# EAGLE design MaxMotor (EAGLE 7.7.0)
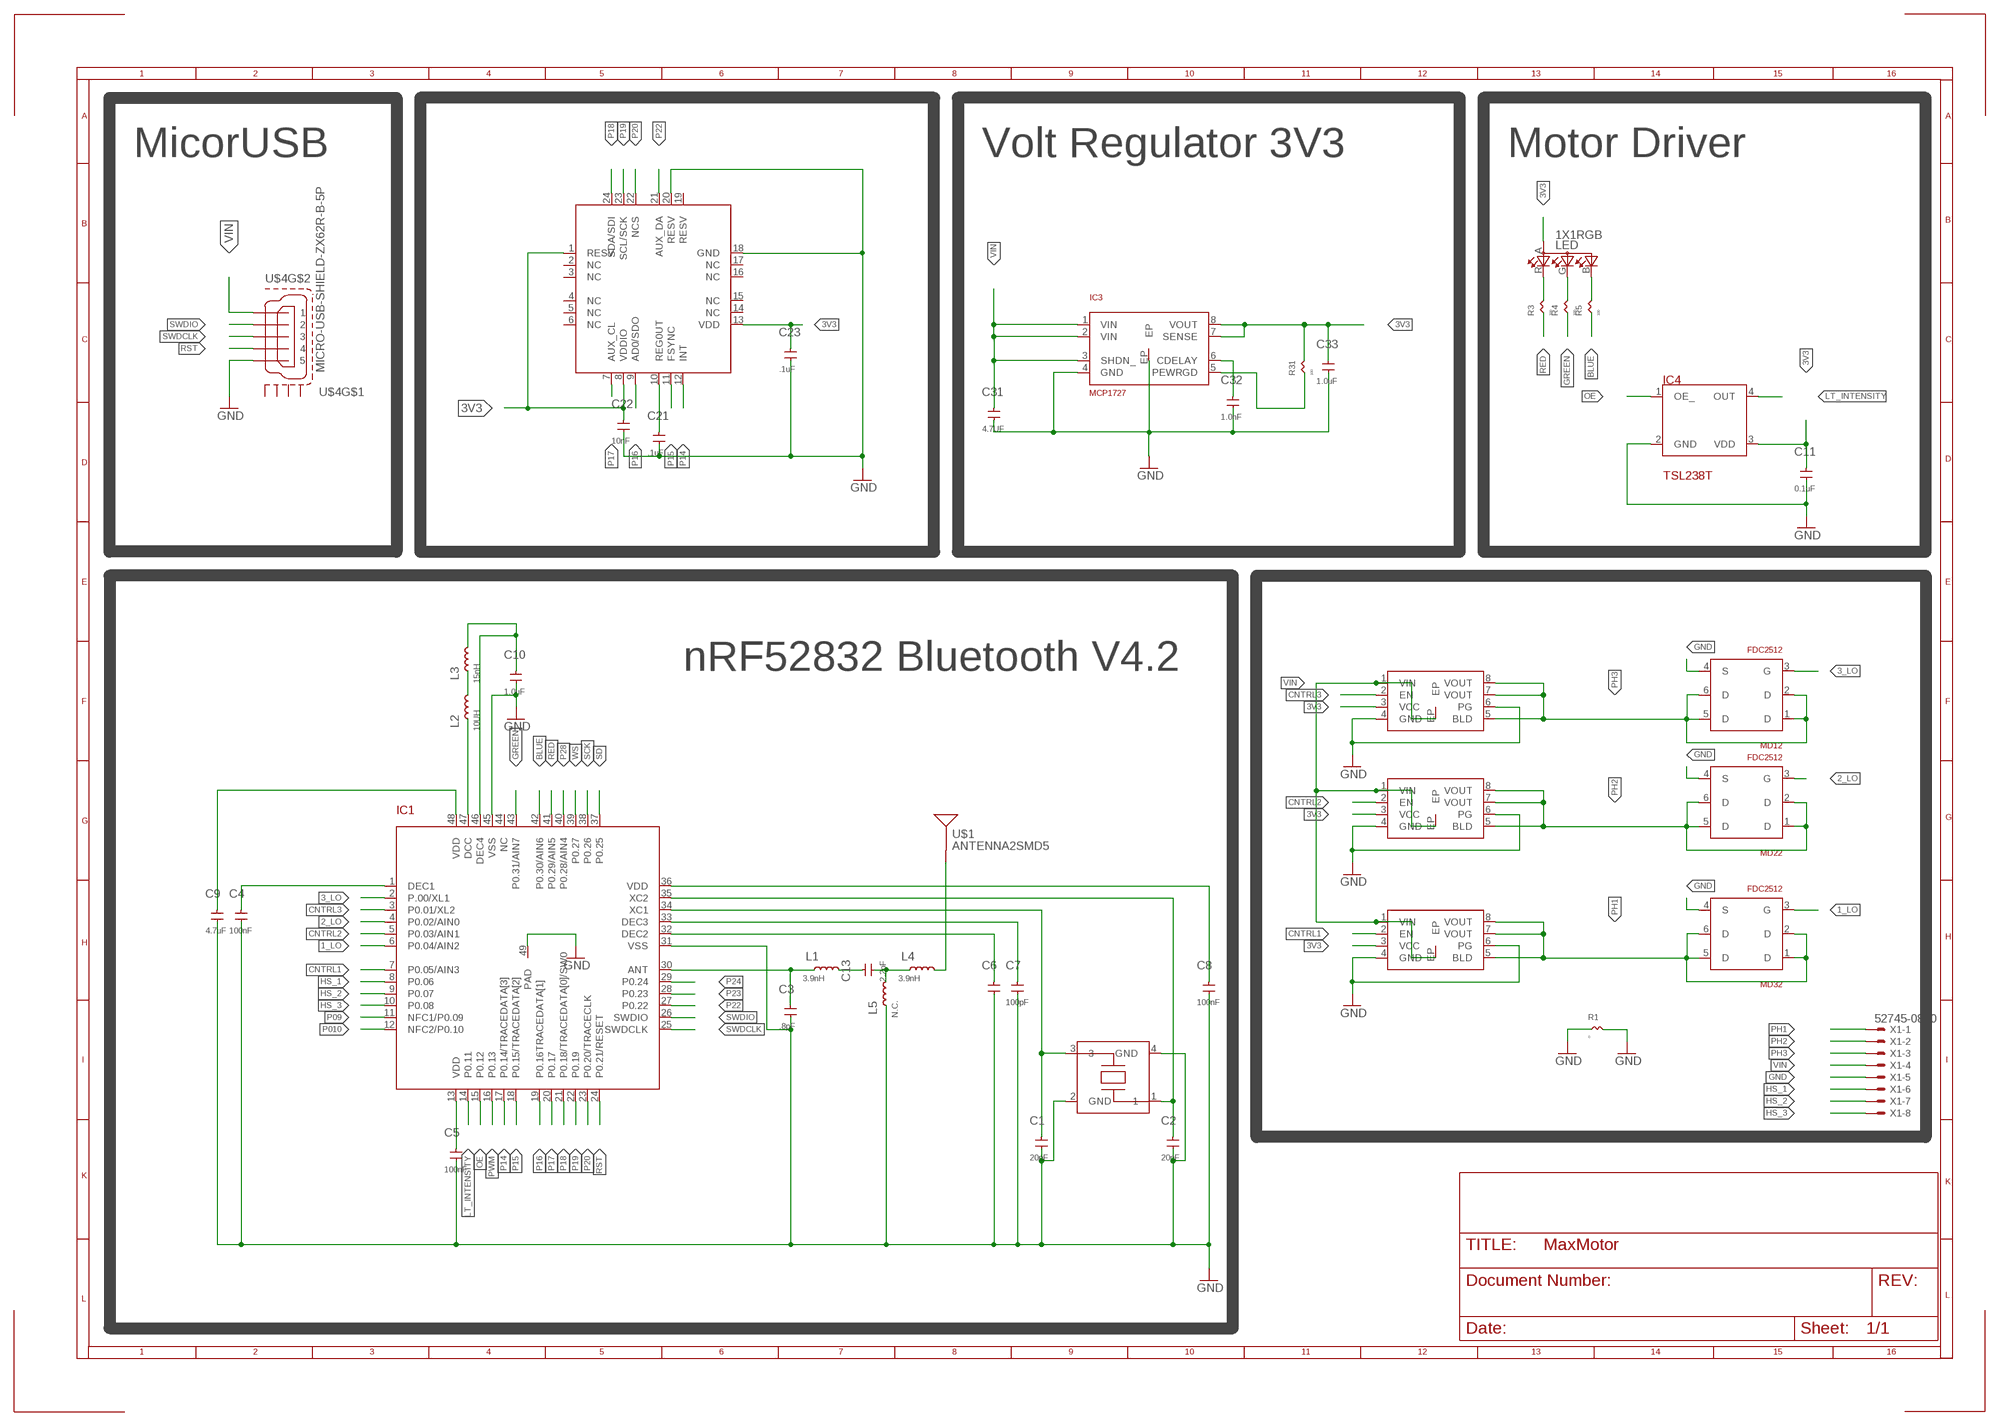
[diagram p0: schematic, sheet 1, part 1 of 2]
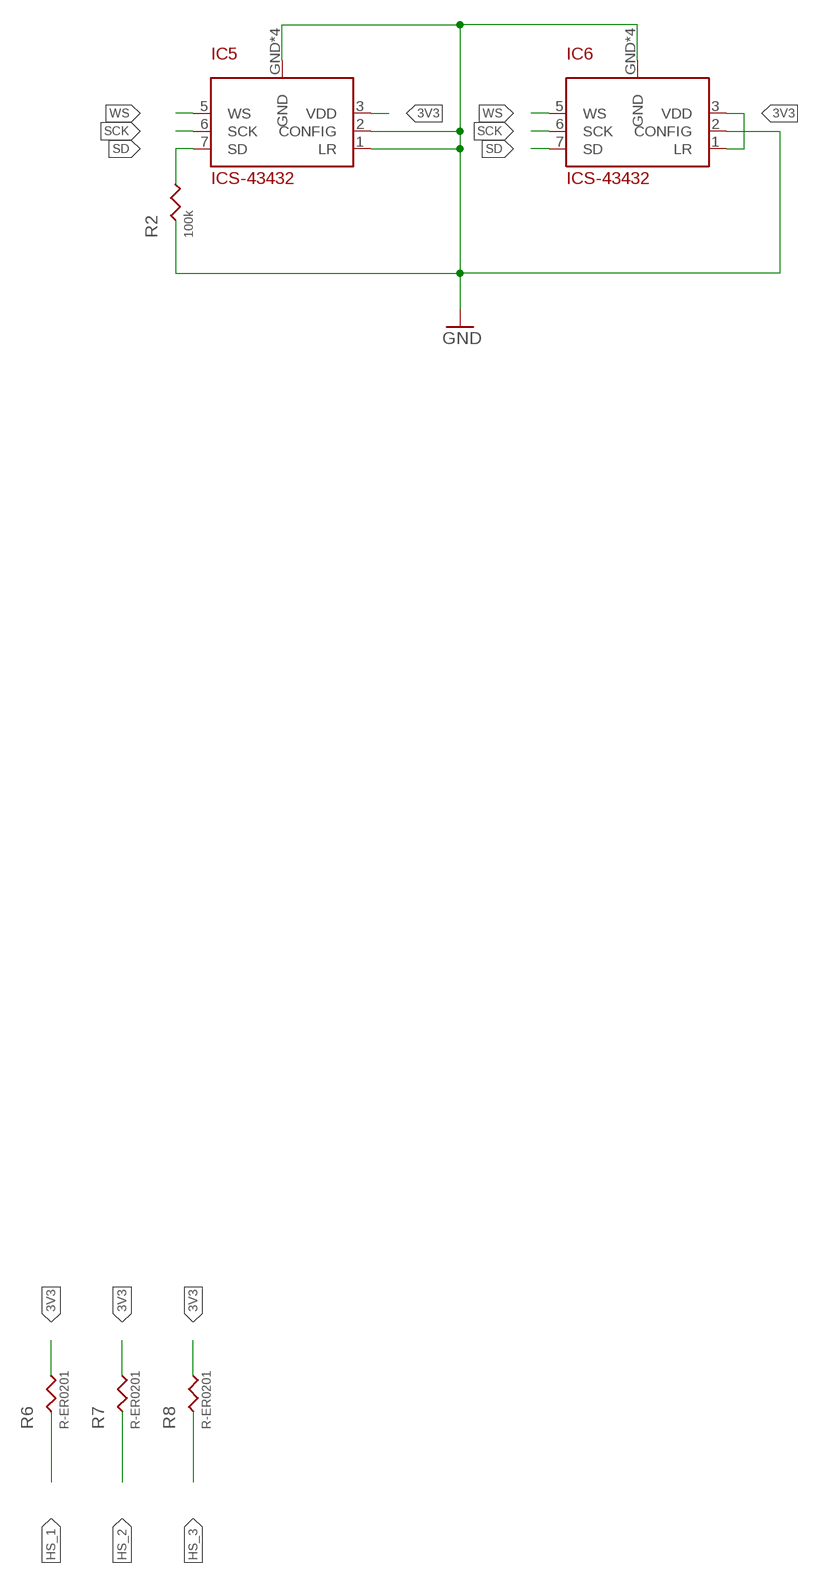
[diagram p1: schematic, sheet 1, part 2 of 2]

## Parts
C1  20pF  C-ERC0402  [C0402]
C2  20pF  C-ERC0402  [C0402]
C3  .8pF  C-ERC0402  [C0402]
C4  100nF  C-ERC0402  [C0402]
C5  100nF  C-ERC0402  [C0402]
C6  C-ERC0402  [C0402]
C7  100pF  C-ERC0402  [C0402]
C8  100nF  C-ERC0402  [C0402]
C9  4.7uF  C-ER  [C0805]
C10  1.0uF  C-ERC0402  [C0402]
C11  0.1uF  C-ERC0402  [C0402]
C13  2.2pF  C-ERC0402  [C0402]
C21  .1uF  C-ERC0402  [C0402]
C22  10nF  C-ERC0402  [C0402]
C23  .1uF  C-ERC0402  [C0402]
C31  4.7UF  C-ER  [C0805]
C32  1.0nF  C-ERC0402  [C0402]
C33  1.0uF  C-ERC0402  [C0402]
IC1  NRF52832  [QFN48]
IC2  MPU9250_CORRECTED  [3X3_24_QFN_CORRECTED]
IC3  MCP1727  [DFN8-3X3]
IC4  TSL238T  [T4]
IC5  ICS-43432  [ICS-43432]
IC6  ICS-43432  [ICS-43432]
L1  3.9nH  L-ERL402  [R0402]
L2  10UH  L-ERL603  [R0603]
L3  15nH  L-ERL402  [R0402]
L4  3.9nH  L-ERL402  [R0402]
L5  N.C.  L-ERL402  [R0402]
LED  1X1RGB  [1X1]
MD12  FDC2512  [SSOT6]
MD22  FDC2512  [SSOT6]
MD32  FDC2512  [SSOT6]
R1  0  R-ER-TINYR402  [R0402]
R2  100k  R-ERR0402  [R0402]
R3  100  R-ER-TINYR402  [R0402]
R4  100  R-ER-TINYR402  [R0402]
R5  100  R-ER-TINYR402  [R0402]
R6  R-ER0201  [R0201]
R7  R-ER0201  [R0201]
R8  R-ER0201  [R0201]
R31  100  R-ER-TINYR402  [R0402]
U$1  ANTENNA2SMD5  [ANTENNA-CHIP5]
U$2  NCP45524/25  [DFN8]
U$4  MICRO-USB-SHIELD-ZX62R-B-5P  [ZX62R-B-5P]
U$5  NCP45524/25  [DFN8]
U$6  NCP45524/25  [DFN8]
X1  52745-0890  [52745-0890]
XTL16M  FA-128  [FA-128]

## Nets
1_LO: IC1.6(P0.04/AIN2) MD32.3(G)
2_LO: IC1.4(P0.02/AIN0) MD22.3(G)
3_LO: IC1.2(P.00/XL1) MD12.3(G)
3V3: C5.2 C8.2 C9.2 C11.2 C22.2 C23.2 C33.2 IC1.13(VDD) IC1.36(VDD) IC1.48(VDD) IC2.1(RESV) IC2.8(VDDIO) IC2.13(VDD) IC3.7(SENSE) IC3.8(VOUT) IC4.3(VDD) IC5.3(VDD) IC6.1(LR) IC6.3(VDD) LED.A(A2) R6.2 R7.2 R8.2 R31.2 U$2.3(VCC) U$5.3(VCC) U$6.3(VCC)
BLUE: IC1.42(P0.30/AIN6) R5.1
CNTRL1: IC1.7(P0.05/AIN3) U$6.2(EN)
CNTRL2: IC1.5(P0.03/AIN1) U$5.2(EN)
CNTRL3: IC1.3(P0.01/XL2) U$2.2(EN)
GND: C1.1 C2.1 C3.1 C4.1 C5.1 C6.1 C7.1 C8.1 C9.1 C10.1 C11.1 C21.1 C22.1 C23.1 C31.1 C32.1 C33.1 IC1.31(VSS) IC1.45(VSS) IC1.49(PAD) IC2.18(GND) IC2.20(RESV) IC3.4(GND) IC3.EP IC4.2(GND) IC5.1(LR) IC5.2(CONFIG) IC5.GND IC5.GND@1(GND) IC5.GND@2(GND) IC5.GND@(GND) IC6.2(CONFIG) IC6.GND IC6.GND@1(GND) IC6.GND@2(GND) IC6.GND@(GND) L5.1 MD12.4(S) MD22.4(S) MD32.4(S) R1.1 R1.2 R2.1 U$2.4(GND) U$2.6(PG) U$4.1 U$5.4(GND) U$5.6(PG) U$6.4(GND) U$6.6(PG) X1.5 XTL16M.2(GND) XTL16M.4(GND)
GREEN: IC1.43(P0.31/AIN7) R4.1
HS_1: IC1.8(P0.06) R6.1 X1.6
HS_2: IC1.9(P0.07) R7.1 X1.7
HS_3: IC1.10(P0.08) R8.1 X1.8
LT_INTENSITY: IC1.14(P0.11) IC4.4(OUT)
N$1: C21.2 IC2.10(REG0UT)
N$4: C3.2 IC1.30(ANT) L1.1
N$5: C6.2 IC1.32(DEC2)
N$6: C13.2 L1.2
N$7: C7.2 IC1.33(DEC3)
N$8: C1.2 IC1.34(XC1) XTL16M.3
N$9: C2.2 IC1.35(XC2) XTL16M.1
N$11: IC1.47(DCC) L2.1
N$12: L2.2 L3.1
N$13: C10.2 IC1.46(DEC4) L3.2
N$16: LED.B(CGREEN) R5.2
N$19: C13.1 L4.1 L5.2
N$20: L4.2 U$1.FEED(SIGNAL)
N$24: LED.G(CBLUE) R4.2
N$25: IC3.5(PEWRGD) R31.1
N$26: LED.R(CRED) R3.2
N$27: C32.2 IC3.6(CDELAY)
N$36: C4.2 IC1.1(DEC1)
OE: IC1.15(P0.12) IC4.1(OE_)
P09: IC1.11(NFC1/P0.09)
P010: IC1.12(NFC2/P0.10)
P14: IC1.17(P0.14/TRACEDATA[3]) IC2.12(INT)
P15: IC1.18(P0.15/TRACEDATA[2]) IC2.11(FSYNC)
P16: IC1.19(P0.16TRACEDATA[1]) IC2.9(AD0/SDO)
P17: IC1.20(P0.17) IC2.7(AUX_CL)
P18: IC1.21(P0.18/TRACEDATA[0]/SW0) IC2.24(SDA/SDI)
P19: IC1.22(P0.19) IC2.23(SCL/SCK)
P20: IC1.23(P0.20/TRACECLK) IC2.22(NCS)
P22: IC1.27(P0.22) IC2.21(AUX_DA)
P23: IC1.28(P0.23)
P24: IC1.29(P0.24)
P28: IC1.40(P0.28/AIN4)
PH1: MD32.1(D) MD32.2(D) MD32.5(D) MD32.6(D) U$6.5(BLD) U$6.7(VOUT) U$6.8(VOUT) X1.1
PH2: MD22.1(D) MD22.2(D) MD22.5(D) MD22.6(D) U$5.5(BLD) U$5.7(VOUT) U$5.8(VOUT) X1.2
PH3: MD12.1(D) MD12.2(D) MD12.5(D) MD12.6(D) U$2.5(BLD) U$2.7(VOUT) U$2.8(VOUT) X1.3
PWM: IC1.16(P0.13)
RED: IC1.41(P0.29/AIN5) R3.1
RST: IC1.24(P0.21/RESET) U$4.2
SCK: IC1.38(P0.26) IC5.6(SCK) IC6.6(SCK)
SD: IC1.37(P0.25) IC5.7(SD) IC6.7(SD) R2.2
SWDCLK: IC1.25(SWDCLK) U$4.3
SWDIO: IC1.26(SWDIO) U$4.4
VIN: C31.2 IC3.1(VIN) IC3.2(VIN) IC3.3(SHDN_) U$2.1(VIN) U$2.EP U$4.5 U$5.1(VIN) U$5.EP U$6.1(VIN) U$6.EP X1.4
WS: IC1.39(P0.27) IC5.5(WS) IC6.5(WS)
Unconnected: IC1.44(NC) IC2.2(NC) IC2.3(NC) IC2.4(NC) IC2.5(NC) IC2.6(NC) IC2.14(NC) IC2.15(NC) IC2.16(NC) IC2.17(NC) IC2.19(RESV) U$4.M1(S1) U$4.M2(S2) U$4.M3(S3) U$4.M4(S4)

## Notes on the sheet
- MicorUSB | Volt Regulator 3V3 | Motor Driver
- nRF52832 Bluetooth V4.2

## Library data of the parts
C1-C11 C13 C21-C23 C31-C33 = rcl:C-ER
IC1 = Nordic:NRF52832
IC2 = invensense:MPU9250_CORRECTED
IC3 = microchip:MCP1727
IC4 = AMS:TSL238T
IC5 IC6 = invensense:ICS-43432
L1-L5 = rcl:L-ER
LED = led:1X1RGB
MD12 MD22 MD32 = transistor-fet:FDC2512
R1 R3-R5 R31 = rcl:R-ER-TINY
R2 R6-R8 = rcl:R-ER
U$1 = SparkFun:ANTENNA2: Antenna Single endded antenna. Common with smaller chip antennas. CHIP4 package is the GPS Chip Antenna SKU: GPS-08418. CHIP5 package is 2.4GHz chip antenna SKU: WRL-00144.
U$2 U$5 U$6 = transistor-fet:NCP45524/25
U$4 = con-hirose:MICRO-USB-SHIELD-: Hirose Micro USB Connector ZX62R-B-5P: Micro B, reverse (top mount) shell SMT Supplier: DigiKey H11574CT-ND Source: http://www.hirose.co.jp/cataloge_hp/e24200011.pdf
X1 = con-molex:52745-0890: FFC/FPC-to-Board 0.50mm (.020") SMT Top Contact Right Angle, ZIF, Style Receptacle 52745 / 52435 Source: http://www.molex.com/product/ffc/52745.html
XTL16M = crystal:FA-128

## Board
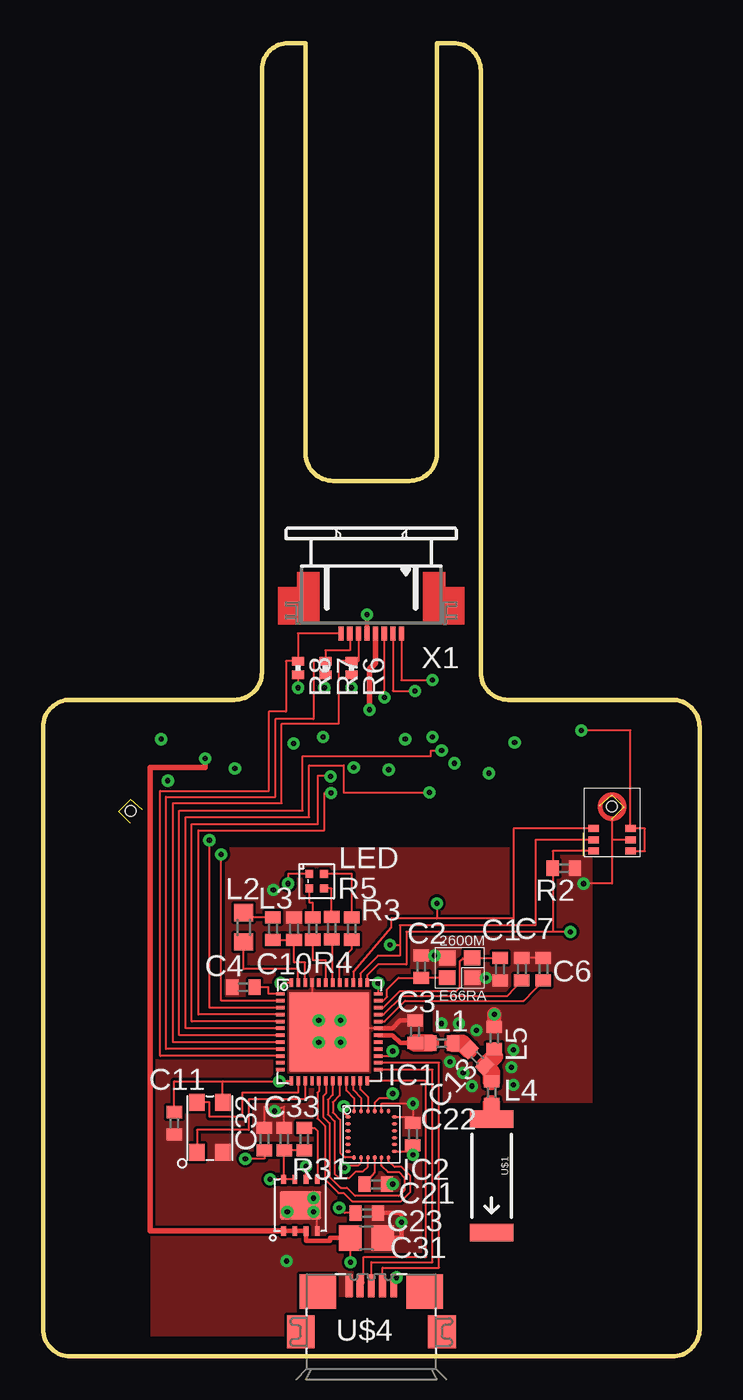
[diagram p2: board, top side]
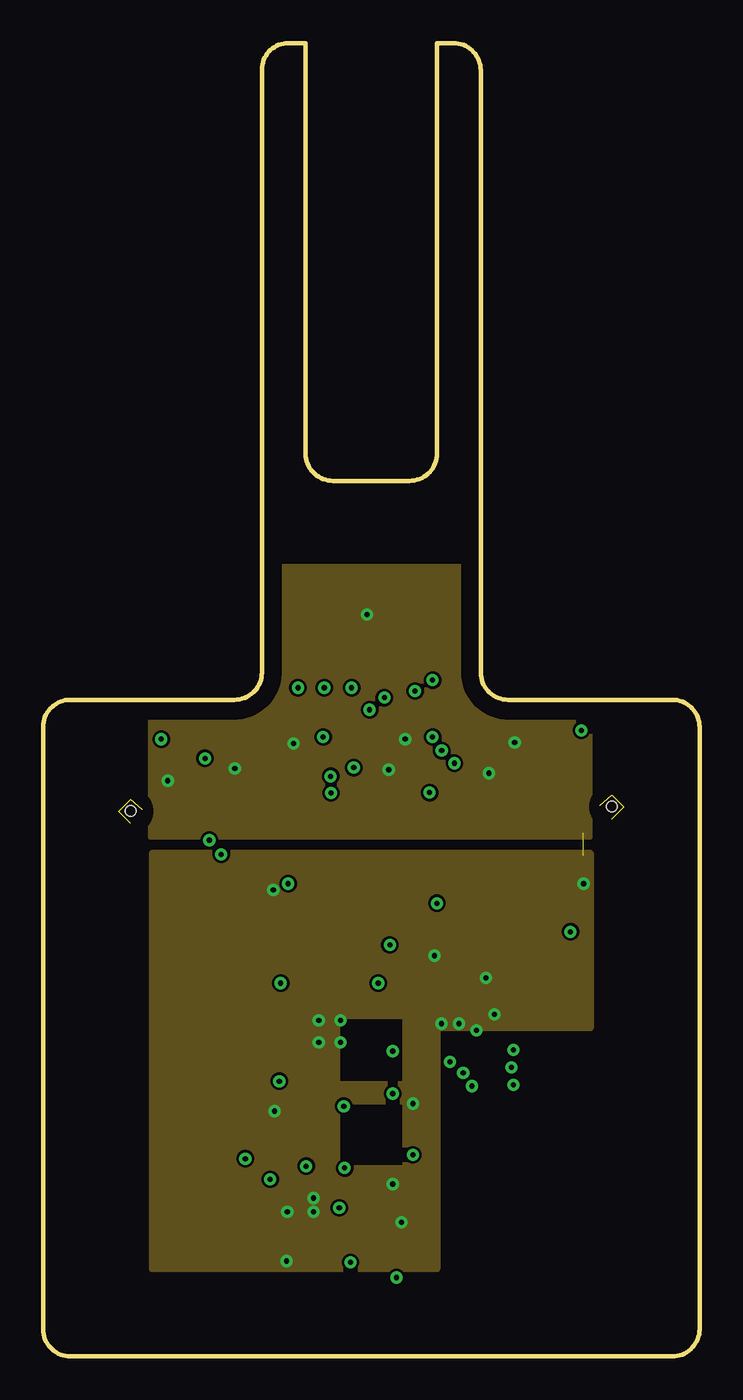
[diagram p3: board, inner layer Route2]
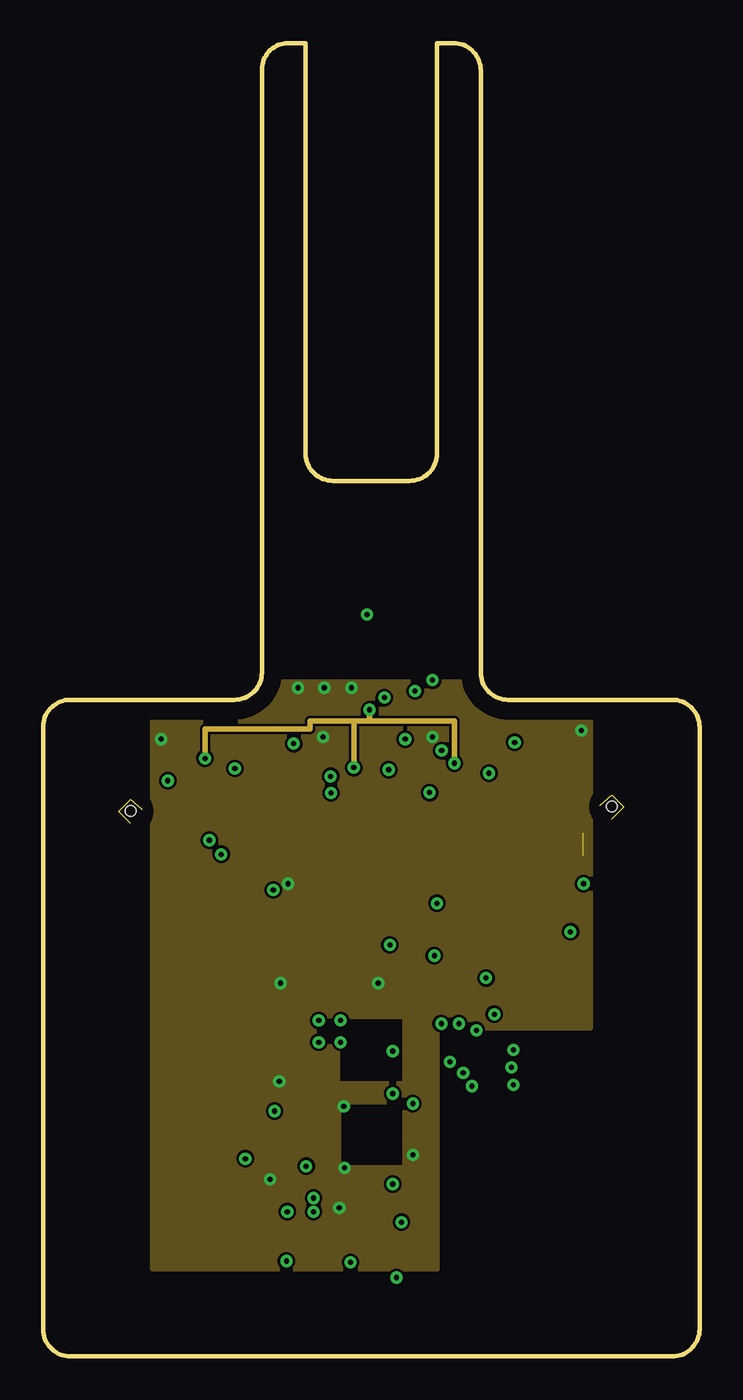
[diagram p4: board, inner layer Route3]
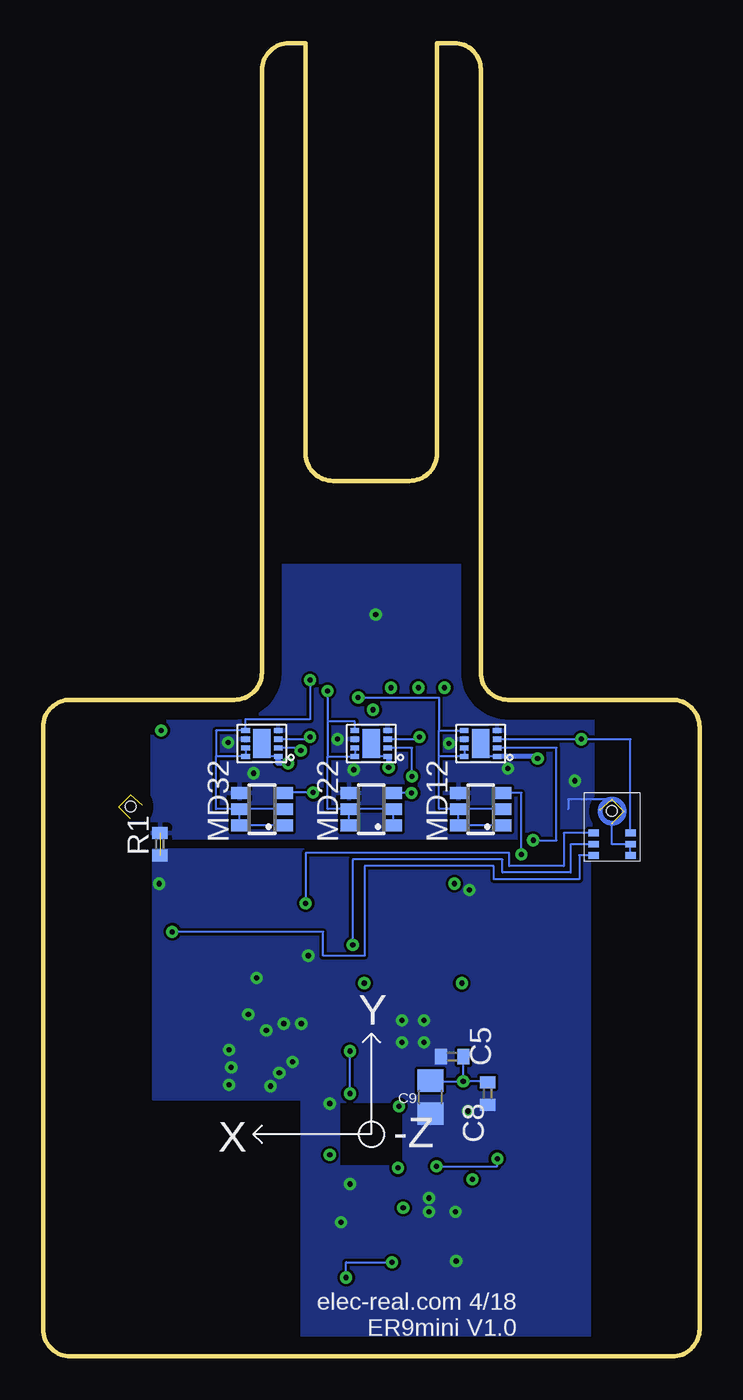
[diagram p5: board, bottom side, seen from below]

Size 38.1 x 76.2 mm. Coordinates in mm from the lower left corner, seen from the top.
Outline: 1.59,0 36.51,0 arc90 38.1,1.59 38.1,36.51 arc90 36.51,38.1 26.99,38.1 arc-90 25.4,39.69 25.4,74.61 arc90 23.81,76.2 22.86,76.2 22.86,52.39 arc-90 21.27,50.8 16.83,50.8 arc-90 15.24,52.39 15.24,76.2 14.22,76.2 arc90 12.7,74.68 12.7,39.69 arc-90 11.11,38.1 1.59,38.1 arc90 0,36.51 0,1.59 arc90 1.59,0
Copper layers (1*2+3*16): Top 0.055mm / dielectric 0.46mm / Route2 0.055mm / dielectric 0.46mm / Route3 0.055mm / dielectric 0.46mm / Bottom 0.055mm
Design rules "default *": minimum track width 5mil, minimum drill 11mil, track to track 6mil, track to pad 6mil, pad to pad 6mil, via to via 6mil, smd to smd 6mil, copper to edge 40mil, drill to drill 8mil, minimum pad ring 10mil, minimum via ring 8mil, stop-mask expansion 4mil, vias tented up to drill 0mil, thermal gap 10mil

### Footprints (pad centres in the part's own frame; a part is rotated, then mirrored left to right if it is on the bottom)
C0402 = smd 0.7 x 0.9: 1 -0.65,0; 2 0.65,0
C0805 = smd 1.3 x 1.5: 1 -0.95,0; 2 0.95,0
QFN48 = smd 0.5 x 0.2: 1 -2.85,2.2; 2 -2.85,1.8; 3 -2.85,1.4; 4 -2.85,1; 5 -2.85,0.6; 6 -2.85,0.2; 7 -2.85,-0.2; 8 -2.85,-0.6; 9 -2.85,-1; 10 -2.85,-1.4; 11 -2.85,-1.8; 12 -2.85,-2.2; 25 2.85,-2.2; 26 2.85,-1.8; 27 2.85,-1.4; 28 2.85,-1; 29 2.85,-0.6; 30 2.85,-0.2; 31 2.85,0.2; 32 2.85,0.6; 33 2.85,1; 34 2.85,1.4; 35 2.85,1.8; 36 2.85,2.2 | smd 0.2 x 0.5: 13 -2.2,-2.85; 14 -1.8,-2.85; 15 -1.4,-2.85; 16 -1,-2.85; 17 -0.6,-2.85; 18 -0.2,-2.85; 19 0.2,-2.85; 20 0.6,-2.85; 21 1,-2.85; 22 1.4,-2.85; 23 1.8,-2.85; 24 2.2,-2.85; 37 2.2,2.85; 38 1.8,2.85; 39 1.4,2.85; 40 1,2.85; 41 0.6,2.85; 42 0.2,2.85; 43 -0.2,2.85; 44 -0.6,2.85; 45 -1,2.85; 46 -1.4,2.85; 47 -1.8,2.85; 48 -2.2,2.85 | smd 4.6 x 4.6: 49 0,0
3X3_24_QFN_CORRECTED = smd 0.3 x 0.2: 1 -1.35,1; 2 -1.35,0.6; 3 -1.35,0.2; 4 -1.35,-0.2; 5 -1.35,-0.6; 6 -1.35,-1; 13 1.35,-1; 14 1.35,-0.6; 15 1.35,-0.2; 16 1.35,0.2; 17 1.35,0.6; 18 1.35,1 | smd 0.2 x 0.3: 7 -1,-1.35; 8 -0.6,-1.35; 9 -0.2,-1.35; 10 0.2,-1.35; 11 0.6,-1.35; 12 1,-1.35; 19 1,1.35; 20 0.6,1.35; 21 0.2,1.35; 22 -0.2,1.35; 23 -0.6,1.35; 24 -1,1.35
DFN8-3X3 = smd 0.5 x 0.3: 1 -1.5,0.975; 2 -1.5,0.325; 3 -1.5,-0.325; 4 -1.5,-0.975; 5 1.5,-0.975; 6 1.5,-0.325; 7 1.5,0.325; 8 1.5,0.975 | smd 1.6 x 2.4: EP 0,0
T4 = smd 1 x 0.9: 1 -1.45,0.75; 2 -1.45,-0.75; 3 1.45,-0.75; 4 1.45,0.75
ICS-43432 = smd 0.6 x 0.4: 1 1.075,-0.65; 2 1.075,0; 3 1.075,0.65; 5 -1.075,0.65; 6 -1.075,0; 7 -1.075,-0.65 | smd 0.1 x 0.1: GND 0.7,1.9; GND@ 0,1.2; GND@1 0,2.6; GND@2 -0.7,2 | hole 0.6: 0,1.925
R0402 = smd 0.7 x 0.9: 1 -0.65,0; 2 0.65,0
R0603 = smd 1 x 1.1: 1 -0.85,0; 2 0.85,0
1X1 = smd 0.45 x 0.45: A 0.425,0.425; B -0.425,-0.425; G -0.425,0.425; R 0.425,-0.425
SSOT6 = smd 0.69 x 0.99: 1 -0.95,-1.3; 2 0,-1.3; 3 0.95,-1.3; 4 0.95,1.3; 5 0,1.3; 6 -0.95,1.3
R0201 = smd 0.5 x 0.7: 1 -0.4,0; 2 0.4,0
ANTENNA-CHIP5 = smd 1.016 x 2.54: FEED -3.302,0; NC 3.302,0
DFN8 = smd 0.5 x 0.3: 1 -0.95,0.75; 2 -0.95,0.25; 3 -0.95,-0.25; 4 -0.95,-0.75; 5 0.95,-0.75; 6 0.95,-0.25; 7 0.95,0.25; 8 0.95,0.75 | smd 1 x 1.7: EP 0,0
ZX62R-B-5P = smd 1.35 x 0.4: 1 2.675,1.3; 2 2.675,0.65; 3 2.675,0; 4 2.675,-0.65; 5 2.675,-1.3 | smd 1.9 x 1.6: M1 0,-4.1; M2 0,4.1 | smd 2 x 2.1: M3 2.35,3.1; M4 2.35,-3.1
52745-0890 = smd 0.3 x 0.8: 1 -1.75,2.5; 2 -1.25,2.5; 3 -0.75,2.5; 4 -0.25,2.5; 5 0.25,2.5; 6 0.75,2.5; 7 1.25,2.5; 8 1.75,2.5
FA-128 = smd 0.95 x 0.85: 1 -0.725,-0.575; 2 0.725,-0.575; 3 0.725,0.575; 4 -0.725,0.575

### Placement (x,y rotation side)
C1  26.52,22.47 90 top
C2  21.95,22.62 270 top
C3  21.59,18.83 270 top
C4  11.63,21.42 0 top
C5  14.36,17.39 0 bottom
C6  29.03,22.47 270 top
C7  27.79,22.47 270 top
C8  12.29,15.25 90 bottom
C9  15.62,15.05 90 bottom
C10  14.57,24.82 270 top
C11  7.62,13.53 90 top
C13  25.18,17.33 135 top
C21  19.3,9.99 180 top
C22  21.46,12.89 270 top
C23  18.8,8.32 180 top
C31  18.77,6.87 180 top
C32  12.85,12.61 270 top
C33  14,12.61 270 top
IC1  16.61,18.83 0 top
IC2  19.05,12.89 0 top
IC3  14.94,8.78 90 top
IC4  9.68,13.3 90 top
IC5  5.08,29.72 0 bottom
IC6  33.02,29.97 0 top
L1  23.14,18.17 0 top
L2  11.65,24.89 90 top
L3  13.35,24.82 270 top
L4  26.04,15.3 270 top
L5  26.19,18.48 270 top
LED  15.88,27.57 90 top
MD12  12.7,31.75 90 bottom
MD22  19.05,31.75 90 bottom
MD32  25.4,31.75 90 bottom
R1  31.32,29.72 90 bottom
R2  30.23,28.32 180 top
R3  17.92,24.83 90 top
R4  15.66,24.83 90 top
R5  16.75,24.84 90 top
R6  17.91,39.94 270 top
R7  16.38,39.94 270 top
R8  14.8,39.94 270 top
R31  15.16,12.61 270 top
U$1  26.04,10.48 270 top
U$2  12.7,35.56 180 bottom
U$4  19.05,1.42 90 top
U$5  19.05,35.56 180 bottom
U$6  25.4,35.56 180 bottom
X1  19.05,44.45 180 top
XTL16M  24.18,22.54 0 top

### Tracks (layer width: path | path; a pad name or v marks a point on that pad's centre or on a via)
1_LO  (via drill 0.3)
  Top 0.127: IC1.6 8.28,19.03 8.28,31.29 15.44,31.29 15.44,34.29 17.45,34.29 17.45,32.72 v22.43,32.72
  Bottom 0.127: v22.43,32.72 24.1,32.72 MD32.3
2_LO  (via drill 0.3)
  Top 0.127: IC1.4 9.02,19.83 9.02,30.53 16.33,30.53 16.33,32.69 v16.71,32.69
  Bottom 0.127: v16.71,32.69 v16.71,32.7 MD22.3
3_LO  (via drill 0.3)
  Top 0.127: IC1.2 10.34,20.63 v10.34,29.13
  Bottom 0.127: v10.34,29.13 10.34,32.7 MD12.3
3V3  (via drill 0.3)
  Top 0.127: IC1.48 13.8,21.68 v13.79,21.65 | IC1.36 19.46,21.47 v19.46,21.65 | IC3.7 IC3.8 | R31.2 C33.2 13.96,11.96 IC3.8 | IC3.8 13.49,10.28 v13.18,10.27 | IC2.8 18.45,11.22 18.29,11.06 17.68,11.06 v17.5,10.94 | IC2.13 21.27,11.89 v21.46,11.7 C22.2 | IC2.1 17.45,14.14 v17.45,14.52 | C23.2 17.5,8.32 v17.2,8.62 | IC4.3 10.43,15.96 | 10.43,15.96 v13.72,15.96 14.41,15.96 IC1.13 | C11.2 7.62,15.96 10.43,15.96 | LED.A 14.22,28 v14.22,27.43 | v31.24,36.32 34.09,36.32 IC6.3 34.92,30.62 34.92,29.32 IC6.1 | R6.2 v17.91,38.8 | R7.2 16.45,38.8 v16.32,38.8 | R8.2 v14.8,38.8
  Bottom 0.127: C8.2 12.29,15.96 v13.72,15.96 | v13.72,15.96 13.72,17.06 C5.2 | C9.2 15.62,15.96 v13.72,15.96 | U$6.3 22.61,35.81 v22.61,35.94 | U$5.3 16.26,35.81 v16.26,35.94 | IC5.3 4,35.81 v6.86,35.81 U$2.3
  pour Route3 (no thermals): 6.35,39.12 31.75,39.12 31.75,19.05 22.86,19.05 22.86,5.08 6.35,5.08
BLUE
  Top 0.127: IC1.42 16.81,24.13 R5.1
CNTRL1  (via drill 0.3)
  Top 0.127: IC1.7 7.9,18.63 7.9,31.67 15.06,31.67 15.06,34.82 22.5,34.82 22.5,35.15 v23.14,35.15
  Bottom 0.127: v23.14,35.15 23.14,35.31 U$6.2
CNTRL2  (via drill 0.3)
  Top 0.127: IC1.5 8.64,19.43 8.64,30.89 15.95,30.89 15.95,33.71 16.69,33.71 v16.69,33.66
  Bottom 0.127: v16.69,33.66 16.69,35.31 U$5.2
CNTRL3  (via drill 0.3)
  Top 0.127: IC1.3 9.65,20.23 v9.65,29.95
  Bottom 0.127: v9.65,29.95 8.31,29.95 8.31,35.31 U$2.2
GND  (via drill 0.3)  (7 unrouted)
  Top 0.127: C33.1 13.99,14.49 v13.44,14.24 12.85,14.49 C32.1 | IC3.4 15.91,8.18 v15.7,8.39 | C2.1 22.69,23.27 v22.71,23.25 22.84,23.12 XTL16M.4 | XTL16M.2 25.67,21.97 v25.7,21.96 26.38,21.96 C1.1 | C6.1 C7.1 | IC1.45 15.61,19.89 v16,19.49 | IC1.31 17.73,19.03 v17.27,19.49 | v16,18.22 IC1.49 | IC2.20 19.65,14.67 v21.46,14.67 C22.1 21.46,13.89 IC2.18 | C21.1 v20.29,9.99 v20.3,9.99 | IC6.GND@ 33.02,29.97 | 33.02,29.97 33.02,27.43 v31.37,27.43 | IC6.2 33.02,29.97
  Top 0.254: C31.1 20.8,6.87 v20.8,7.79 20.8,8.32 C23.1 | IC1.31 20.27,19.03 20.73,19.49 21.58,19.49 C3.1 | X1.5 v18.8,43.05
  Top 0.813: L5.1 v26.19,19.85
  Bottom 0.127: IC5.GND@1 7.62,32.32 7.62,31.75 | IC5.1 IC5.2 5.08,29.72 IC5.GND@
  other vias: 15.7,9.18 17.27,18.22 14.17,8.39 23.62,17.08 24.38,16.45 24.89,15.68 13.36,27.06 14.54,35.56 21.02,35.81 27.37,35.62 11.13,34.11 25.88,33.83 14.12,5.54 20.07,34.04 23.11,19.3 24.13,19.3 25.15,18.92 27.3,17.78 27.18,16.76 27.3,15.75 7.24,33.4
  pour Bottom (no thermals): 6.35,0.19 6.35,29.4 31.75,29.4 31.75,14.92 23.11,14.92 23.11,0.19
  pour Top (no thermals): 6.35,0.19 6.35,29.4 31.75,29.4 31.75,0.19
  pour Route2 (no thermals): 6.35,29.21 31.75,29.21 31.75,19.05 22.86,19.05 22.86,5.08 6.35,5.08
  pour Bottom: 31.75,30.23 31.75,30.1 6.22,30.1 6.22,45.85 27.56,45.85 31.75,45.85
  pour Route2: 31.75,30.23 31.75,45.85 21.08,45.85 6.22,45.85 6.22,31.75 6.22,30.1 31.75,30.1
GREEN
  Top 0.127: IC1.43 16.41,22.99 15.66,22.99 R4.1
HS_1
  Top 0.127: IC1.8 7.54,18.23 7.54,32.11 13.84,32.11 13.84,36.7 17.14,36.7 17.14,40.34 R6.1 18.3,40.34 X1.6
HS_2
  Top 0.127: IC1.9 7.14,17.83 7.14,32.46 13.49,32.46 13.49,36.98 15.68,36.98 15.68,40.34 R7.1 16.38,40.96 17.8,40.96 X1.7
HS_3
  Top 0.127: IC1.10 6.81,17.43 6.81,32.82 13.11,32.82 13.11,37.41 14.1,37.41 14.1,40.34 R8.1 14.8,41.95 X1.8
LT_INTENSITY
  Top 0.127: IC1.14 14.81,15.3 11.56,15.3 11.56,13.91 9.65,13.91 9.65,14.75 IC4.4
N$1
  Top 0.127: IC2.10 19.25,10.69 C21.2
N$2
  cutout Route2: 17.27,19.56 20.83,19.56 20.83,16 17.27,16
N$3
  cutout Route3: 17.34,14.61 20.83,14.61 20.83,11.11 17.34,11.11
N$4
  Top 0.254: IC1.30 20.29,18.63 20.74,18.18 C3.2
  Top 0.813: 22.49,18.18 L1.1
  Top 1.016: C3.2 22.49,18.18
N$5
  Top 0.127: IC1.32 19.83,19.43 21.01,20.64 27.9,20.64 C6.2
N$6
  Top 1.016: L1.2 24.34,18.17 C13.2
N$7
  Top 0.127: IC1.33 19.77,19.83 20.85,20.92 26.94,20.92 C7.2
N$8
  Top 0.127: XTL16M.3 24.89,23.1 | IC1.34 19.74,20.23 20.7,21.2 23.98,21.2 24.21,21.43 24.21,22.95 24.36,23.1 24.89,23.1 | C1.2 26.5,23.1 24.89,23.1
N$9
  Top 0.127: 21.95,21.96 C2.2 | IC1.35 19.73,20.63 19.96,20.87 19.96,21.3 20.64,21.97 C2.2 | XTL16M.1 C2.2
N$10
  cutout Route2: 17.34,14.61 20.83,14.61 20.83,11.11 17.27,11.11 17.27,14.61
N$11
  Top 0.127: IC1.47 14.81,22.48 11.65,22.48 L2.1
N$12
  Top 0.127: L3.1 11.65,25.47 L2.2
N$13
  Top 0.127: L3.2 C10.2 14.57,22.86 15.21,22.86 IC1.46
N$14
  cutout Route3: 17.27,19.56 20.83,19.56 20.83,16 17.27,16
N$16
  Top 0.127: R5.2 16.75,27.15 LED.B
N$19
  Top 0.813: 26.19,17.42 L5.2
  Top 1.016: L4.1 26.04,16.48 C13.1 26.19,17.42
N$20
  Top 0.127: U$1.FEED 26.05,13.8
  Top 1.016: L4.2 U$1.FEED
N$22
  cutout Bottom: 17.27,14.67 17.27,11.11 20.83,11.11 20.83,14.67
N$23
  cutout Top: 23.11,0.19 23.11,14.67 31.75,14.67 31.75,0.19
N$24
  Top 0.127: R4.2 15.66,26.31 15.47,26.31 15.47,27.15 LED.G
N$25
  Top 0.127: R31.1 15.76,13.26 15.93,13.09 15.93,10.29 IC3.5
N$26
  Top 0.127: R3.2 17.92,28 LED.R
N$27  (via drill 0.3)
  Top 0.127: IC3.6 15.26,10.99 v15.27,11.04 | C32.2 12.85,11.47 v11.73,11.47
  Bottom 0.127: v15.27,11.04 11.73,11.04 v11.73,11.47
N$28
  cutout Top: 17.27,14.67 20.83,14.67 20.83,11.11 17.27,11.11
N$29
  cutout Top: 22.1,20.51 22.61,20.51 22.61,18.73 22.1,18.73
N$36
  Top 0.127: IC1.1 13.08,21.03 13.08,21.43 C4.2
OE
  Top 0.127: IC1.15 15.21,14.92 11.94,14.92 11.94,13.14 8.93,13.14 IC4.1
P14
  Top 0.127: IC1.17 16.01,15.39 15.93,15.3 15.93,13.8 16.36,13.37 16.36,10.27 17.14,9.49 17.45,9.49 17.93,9 20.78,9 21.31,9.54 21.31,10.48 20.8,10.99 20.4,10.99 20.05,11.33 IC2.12
P15
  Top 0.127: IC1.18 16.41,15.26 16.26,15.1 16.26,13.91 16.64,13.53 16.64,10.43 17.27,9.79 17.63,9.79 18.11,9.31 20.65,9.31 20.98,9.64 20.98,10.38 20.65,10.71 20.02,10.71 19.65,11.07 IC2.11
P16
  Top 0.127: IC1.19 16.81,15.17 16.54,14.9 16.54,14.03 16.92,13.65 16.92,10.6 17.17,10.35 17.78,10.35 18.16,10.73 18.57,10.73 18.85,11.01 IC2.9
P17
  Top 0.127: IC1.20 17.21,15.14 16.82,14.74 16.82,14.16 17.25,13.73 17.25,11.82 17.53,11.54 IC2.7
P18
  Top 0.127: IC1.21 17.6,15.43 18.05,14.98 IC2.24
P19
  Top 0.127: IC1.22 18.01,15.46 18.45,15.01 IC2.23
P20
  Top 0.127: IC1.23 18.41,15.48 18.85,15.05 IC2.22
P22  (via drill 0.3)
  Top 0.127: v20.3,15.25 20.14,15 19.53,15 19.25,14.72 IC2.21 | IC1.27 20.3,17.43 v20.3,17.72
  Bottom 0.127: v20.3,15.25 v20.3,17.72
PH1  (via drill 0.3)
  Top 0.127: X1.1 20.8,39.24 v22.61,39.24
  Bottom 0.127: MD32.2 MD32.5 | MD32.1 MD32.6 MD32.5 | 28.07,34.81 U$6.8 U$6.7 | 28.07,34.81 28.07,36.31 U$6.5 26.35,36.96 22.61,36.96 v22.61,39.24 | MD32.5 28.07,31.75 28.07,34.81
PH2  (via drill 0.3)
  Top 0.127: X1.2 20.3,38.61 v21.59,38.61
  Bottom 0.127: MD22.1 MD22.2 MD22.5 | MD22.6 MD22.5 | 21.59,34.81 U$5.8 U$5.7 | 21.59,36.83 21.59,34.81 | U$5.5 20,36.83 21.59,36.83 | MD22.5 21.59,31.75 21.59,34.81 | v21.59,38.61 21.59,36.83
PH3  (via drill 0.3)
  Top 0.127: X1.3 v19.8,38.23 v19.81,38.23
  Bottom 0.127: MD12.2 MD12.5 | MD12.1 MD12.6 MD12.5 | 15.11,36.32 13.65,36.32 U$2.5 | 15.11,34.81 U$2.8 U$2.7 | 15.11,34.81 15.11,36.32 | MD12.5 15.11,31.75 15.11,34.81 | v19.81,38.23 15.11,38.23 15.11,36.32
RED
  Top 0.127: IC1.41 17.21,22.93 17.92,23.64 R3.1
RST
  Top 0.127: IC1.24 22.23,15.98 22.23,5.78 18.61,5.78 18.61,4.3 arc-90 U$4.2
SCK  (via drill 0.3)
  Top 0.127: IC6.6 28.57,29.97 28.57,25.02 20.7,25.02 20.7,23.88 | 20.7,23.88 20.7,23.24 19.43,23.24 18.41,22.22 IC1.38 | v20.13,23.88 20.7,23.88
  Bottom 0.127: IC5.6 7.49,29.72 7.49,28.07 11.43,28.07 11.43,28.83 20.13,28.83 v20.13,23.88
SD  (via drill 0.3)
  Top 0.127: IC6.7 29.58,29.32 R2.2 29.58,24.64 | 29.58,24.64 21.08,24.64 21.08,22.73 19.43,22.73 18.81,22.11 IC1.37 | v30.61,24.64 29.58,24.64
  Bottom 0.127: IC5.7 6.99,29.07 6.99,27.69 11.94,27.69 11.94,28.45 19.43,28.45 19.43,23.24 21.84,23.24 21.84,24.64 v30.61,24.64
SWDCLK
  Top 0.127: U$4.3 19.05,5.46 22.61,5.46 22.61,16.63 IC1.25
SWDIO
  Top 0.127: U$4.4 19.7,5.14 22.99,5.14 22.99,17.03 IC1.26
VIN  (via drill 0.3)
  Top 0.127: U$4.5 20.35,4.57 v20.51,4.57 | v17.84,5.46 17.84,6.87 C31.2
  Top 0.254: C31.2 16.66,6.87 16.66,6.72 15.26,6.72 IC3.3 IC3.2 IC3.1
  Top 0.305: IC3.1 6.22,7.28 6.22,34.16 9.4,34.16 v9.4,34.7 | X1.4 19.3,40.23 18.95,39.88 v18.95,37.52
  Route3 0.305: v23.88,34.42 23.88,36.88 18.92,36.88 | 18.92,36.88 18.06,36.88 | 18.06,36.88 15.49,36.88 15.49,36.4 9.4,36.4 v9.4,34.7 | v18.03,34.16 18.06,34.16 18.06,36.88 | v18.95,37.52 18.95,36.91 18.92,36.88
  Bottom 0.127: v20.51,4.57 20.51,5.46 v17.84,5.46 | U$2.1 12.7,34.81 U$2.EP | U$5.1 19.05,34.81 U$5.EP | U$6.1 25.4,34.81 U$6.EP
  Bottom 0.305: U$6.1 24.45,34.42 v23.88,34.42 | U$2.1 9.41,34.82 v9.4,34.7 | U$5.1 18.03,34.81 v18.03,34.16
WS  (via drill 0.3)
  Top 0.127: IC6.5 27.3,30.62 27.3,25.4 22.86,25.4 | 22.86,25.4 20.19,25.4 20.19,24.89 18.01,22.33 IC1.39 | v22.86,26.29 22.86,25.4
  Bottom 0.127: IC5.5 7.87,30.37 7.87,28.45 11.05,28.45 11.05,29.21 22.86,29.21 v22.86,26.29

### Text on the board
bPlace: Y | -Z | X | elec-real.com 4/18 / ER9mini V1.0